# Altium project High Power Brushed DC MC.PrjPcb
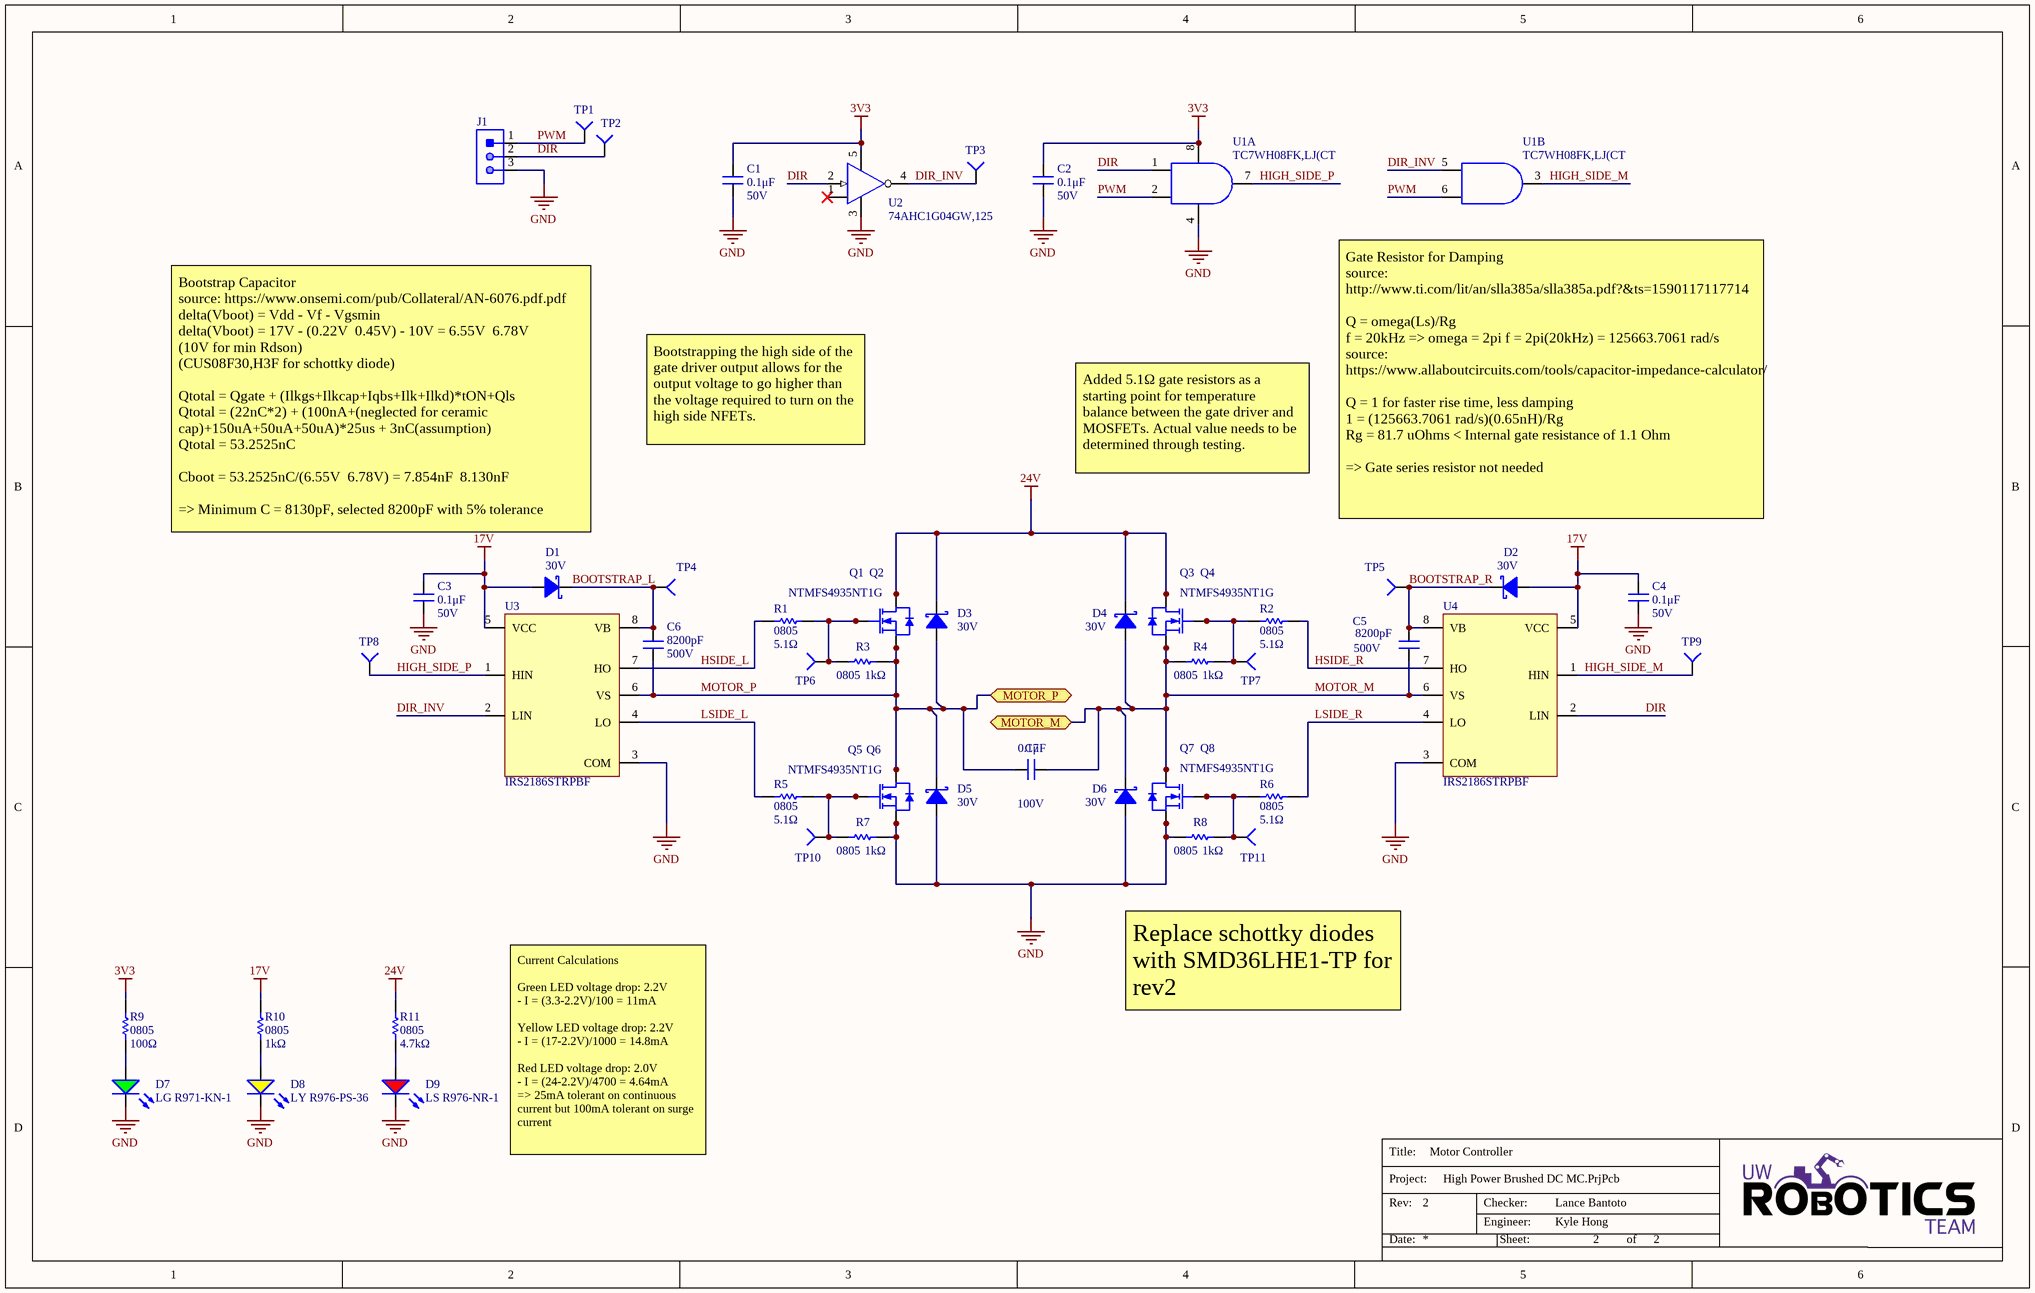
[diagram p0: SH2 - MOTOR CONTROLLER.SchDoc]
2 sheets, 83 parts. Net scope: flat (ports and power ports of the same name join across sheets).
Board file: High Power Brushed DC MC.PcbDoc
Sheets:
  SH2 - MOTOR CONTROLLER.SchDoc
  SH1 - CONNECTORS AND POWER.SchDoc

## Sheet SH2 - MOTOR CONTROLLER.SchDoc: Motor Controller
size B; CheckedBy: Lance Bantoto; DrawnBy: K Hong; Engineer: Kyle Hong; Revision: 2; SheetNumber: 2; SheetTotal: 2

### Parts
C1  Voltage Rating: 50V  [CAP2012]  (hidden comment: 0.1μF)
C2  Voltage Rating: 50V  [CAP2012]  (hidden comment: 0.1μF)
C3  Voltage Rating: 50V  [CAP2012]  (hidden comment: 0.1μF)
C4  Voltage Rating: 50V  [CAP2012]  (hidden comment: 0.1μF)
C5  value 8200pF  Voltage Rating (DC): 500V  [CAP1206]  (hidden comment: CAP_8200pF_500V_1206)
C6  value 8200pF  Voltage Rating (DC): 500V  [CAP1206]  (hidden comment: CAP_8200pF_500V_1206)
C7  value 0.1μF  Voltage(DC): 100V  [MKS2D031001A00MSSD]  (hidden comment: CAP_0.1uF_100V_FILM)
D1  Vr (Max): 30V  [SOD-323_UNIDIR]  (hidden comment: DIO_SCHOTTKY_30V_800mA)
D2  Vr (Max): 30V  [SOD-323_UNIDIR]  (hidden comment: DIO_SCHOTTKY_30V_800mA)
D3  Vr (Max): 30V  [SOD-323_UNIDIR]  (hidden comment: DIO_SCHOTTKY_30V_800mA)
D4  Vr (Max): 30V  [SOD-323_UNIDIR]  (hidden comment: DIO_SCHOTTKY_30V_800mA)
D5  Vr (Max): 30V  [SOD-323_UNIDIR]  (hidden comment: DIO_SCHOTTKY_30V_800mA)
D6  Vr (Max): 30V  [SOD-323_UNIDIR]  (hidden comment: DIO_SCHOTTKY_30V_800mA)
D7  LG R971-KN-1  [LED_0805_GREEN]
D8  LY R976-PS-36  [LED_0805_YELLOW]
D9  LS R976-NR-1  [LED_0805_RED]
J1  CON_3M_TERM  [1935174]  (value not drawn)
Q1  NTMFS4935NT1G  [SO8-FL]  (value not drawn)
Q2  NTMFS4935NT1G  [SO8-FL]
Q3  NTMFS4935NT1G  [SO8-FL]
Q4  NTMFS4935NT1G  [SO8-FL]  (value not drawn)
Q5  NTMFS4935NT1G  [SO8-FL]  (value not drawn)
Q6  NTMFS4935NT1G  [SO8-FL]
Q7  NTMFS4935NT1G  [SO8-FL]  (value not drawn)
Q8  NTMFS4935NT1G  [SO8-FL]
R1  value 5.1Ω  Case Code (Imperial): 0805  [RESC2012X60N]  (hidden comment: RES_5.1Ω_0805)
R2  value 5.1Ω  Case Code (Imperial): 0805  [RESC2012X60N]  (hidden comment: RES_5.1Ω_0805)
R3  Case Code (Imperial): 0805  [RESC2012X60N]  (hidden comment: 1kΩ)
R4  Case Code (Imperial): 0805  [RESC2012X60N]  (hidden comment: 1kΩ)
R5  value 5.1Ω  Case Code (Imperial): 0805  [RESC2012X60N]  (hidden comment: RES_5.1Ω_0805)
R6  value 5.1Ω  Case Code (Imperial): 0805  [RESC2012X60N]  (hidden comment: RES_5.1Ω_0805)
R7  Case Code (Imperial): 0805  [RESC2012X60N]  (hidden comment: 1kΩ)
R8  Case Code (Imperial): 0805  [RESC2012X60N]  (hidden comment: 1kΩ)
R9  value 100Ω  Case Code (Imperial): 0805  [RESC2012X60N]  (hidden comment: RES_100Ω_0805)
R10  Case Code (Imperial): 0805  [RESC2012X60N]  (hidden comment: 1kΩ)
R11  value 4.7kΩ  Case Code (Imperial): 0805  [RESC2012X60N]  (hidden comment: RES_4.7kΩ_0805)
TP1  TESTPOINT_1MM_CIRCLE  [TESTPOINT_CIRCLE_1MM]  (value not drawn)  (no BOM)
TP2  TESTPOINT_1MM_CIRCLE  [TESTPOINT_CIRCLE_1MM]  (value not drawn)  (no BOM)
TP3  TESTPOINT_1MM_CIRCLE  [TESTPOINT_CIRCLE_1MM]  (value not drawn)  (no BOM)
TP4  TESTPOINT_1MM_CIRCLE  [TESTPOINT_CIRCLE_1MM]  (value not drawn)  (no BOM)
TP5  TESTPOINT_1MM_CIRCLE  [TESTPOINT_CIRCLE_1MM]  (value not drawn)  (no BOM)
TP6  TESTPOINT_1MM_CIRCLE  [TESTPOINT_CIRCLE_1MM]  (value not drawn)  (no BOM)
TP7  TESTPOINT_1MM_CIRCLE  [TESTPOINT_CIRCLE_1MM]  (value not drawn)  (no BOM)
TP8  TESTPOINT_1MM_CIRCLE  [TESTPOINT_CIRCLE_1MM]  (value not drawn)  (no BOM)
TP9  TESTPOINT_1MM_CIRCLE  [TESTPOINT_CIRCLE_1MM]  (value not drawn)  (no BOM)
TP10  TESTPOINT_1MM_CIRCLE  [TESTPOINT_CIRCLE_1MM]  (value not drawn)  (no BOM)
TP11  TESTPOINT_1MM_CIRCLE  [TESTPOINT_CIRCLE_1MM]  (value not drawn)  (no BOM)
U1  TC7WH08FK,LJ(CT  [8-VFSOP]  (parts A,B of 2)
U2  74AHC1G04GW,125  [SOT353]
U3  IRS2186STRPBF  [8-SOIC_M]
U4  IRS2186STRPBF  [8-SOIC_M]

### Ports
MOTOR_M (bidir), MOTOR_P (bidir)

### Nets
3V3: C1.2 C2.2 R9.2 U1.8(Vcc) U2.5(Vcc)
17V: C3.2 C4.2 D1.1(Anode) D2.1(Anode) R10.2 U3.5(VCC) U4.5(VCC)
24V: D3.2(Cathode) D4.2(Cathode) Q1.3(Drain) Q2.3(Drain) Q3.3(Drain) Q4.3(Drain) R11.2
GND: C1.1 C2.1 C3.1 C4.1 D5.1(Anode) D6.1(Anode) D7.2(K) D8.2(K) D9.2(K) J1.3 Q5.1(Source) Q6.1(Source) Q7.1(Source) Q8.1(Source) R7.2 R8.1 U1.4(GND) U2.3(GND) U3.3(COM) U4.3(COM)
BOOTSTRAP_L: C6.2 D1.2(Cathode) TP4.1(=value) U3.8(VB)
BOOTSTRAP_R: C5.2 D2.2(Cathode) TP5.1(=value) U4.8(VB)
DIR: J1.2 TP2.1(=value) U1.1(A1) U2.2(A) U4.2(LIN)
DIR_INV: TP3.1(=value) U1.5(A2) U2.4(Y) U3.2(LIN)
HIGH_SIDE_M: TP9.1(=value) U1.3(Y2) U4.1(HIN)
HIGH_SIDE_P: TP8.1(=value) U1.7(Y1) U3.1(HIN)
HSIDE_L: R1.1 U3.7(HO)
HSIDE_R: R2.2 U4.7(HO)
LSIDE_L: R5.1 U3.4(LO)
LSIDE_R: R6.2 U4.4(LO)
MOTOR_M: C5.1 C7.2 D4.1(Anode) D6.2(Cathode) Q3.1(Source) Q4.1(Source) Q7.3(Drain) Q8.3(Drain) R4.1 U4.6(VS) ; port MOTOR_M
MOTOR_P: C6.1 C7.1 D3.1(Anode) D5.2(Cathode) Q1.1(Source) Q2.1(Source) Q5.3(Drain) Q6.3(Drain) R3.2 U3.6(VS) ; port MOTOR_P
PWM: J1.1 TP1.1(=value) U1.2(B1) U1.6(B2)
NetD7_1: D7.1(A) R9.1
NetD8_1: D8.1(A) R10.1
NetD9_1: D9.1(A) R11.1
NetQ1_2: Q1.2(Gate) Q2.2(Gate) R1.2 R3.1 TP6.1(=value)
NetQ3_2: Q3.2(Gate) Q4.2(Gate) R2.1 R4.2 TP7.1(=value)
NetQ5_2: Q5.2(Gate) Q6.2(Gate) R5.2 R7.1 TP10.1(=value)
NetQ7_2: Q7.2(Gate) Q8.2(Gate) R6.1 R8.2 TP11.1(=value)

Not connected (* = marked no-connect by the designer): U2 1(NC)*

### Notes on the sheet
- Bootstrapping the high side of the gate driver output allows for the output voltage to go higher than the voltage required to turn on the high side NFETs.
- Added 5.1Ω gate resistors as a starting point for temperature balance between the gate driver and MOSFETs. Actual value needs to be determined through testing.
- Bootstrap Capacitor
  source: https://www.onsemi.com/pub/Collateral/AN-6076.pdf.pdf
  delta(Vboot) = Vdd - Vf - Vgsmin
  delta(Vboot) = 17V - (0.22V  0.45V) - 10V = 6.55V  6.78V
  (10V for min Rdson)
  (CUS08F30,H3F for schottky diode)
  Qtotal = Qgate + (Ilkgs+Ilkcap+Iqbs+Ilk+Ilkd)*tON+Qls
  Qtotal = (22nC*2) + (100nA+(neglected for ceramic cap)+150uA+50uA+50uA)*25us + 3nC(assumption)
  Qtotal = 53.2525nC
  Cboot = 53.2525nC/(6.55V  6.78V) = 7.854nF  8.130nF
  => Minimum C = 8130pF, selected 8200pF with 5% tolerance
- Gate Resistor for Damping
  source: http://www.ti.com/lit/an/slla385a/slla385a.pdf?&ts=1590117117714
  Q = omega(Ls)/Rg
  f = 20kHz => omega = 2pi f = 2pi(20kHz) = 125663.7061 rad/s
  source: https://www.allaboutcircuits.com/tools/capacitor-impedance-calculator/
  Q = 1 for faster rise time, less damping
  1 = (125663.7061 rad/s)(0.65nH)/Rg
  Rg = 81.7 uOhms < Internal gate resistance of 1.1 Ohm
  => Gate series resistor not needed
- Replace schottky diodes with SMD36LHE1-TP for rev2
- Current Calculations
  Green LED voltage drop: 2.2V
  - I = (3.3-2.2V)/100 = 11mA
  Yellow LED voltage drop: 2.2V
  - I = (17-2.2V)/1000 = 14.8mA
  Red LED voltage drop: 2.0V
  - I = (24-2.2V)/4700 = 4.64mA
  => 25mA tolerant on continuous current but 100mA tolerant on surge current
- Title:
- Project:
- Date:
- Rev:
- Checker:
- Engineer:
- Sheet:
- of

### Library data of the parts
C1-C4 = CAP_0.1uF_50V_0805: CAP CER 0.1UF 50V X7R 0805; Manufacturer 1: Murata Electronics; Manufacturer Part Number 1: GCD21BR71H104KA01L; Tolerance: 10%; Mount: Surface Mount; Case Code (Metric): 2012; Case Code (Imperial): 0805; Min Operating Temperature: -55°C; Max Operating Temperature: 125°C; Dielectric: X7R; Termination: SMD/SMT; Length: 2mm; Height: 1.25mm; Width: 0.049inch; Thickness: 0.049inch; Depth: 1.25mm; Ratings: AEC-Q200; Supplier 1: Digi-Key; Supplier Part Number 1: 490-11955-1-ND; Value: 0.1μF; Package: 0805 (2012 Metric)
C5 C6 = CAP_8200pF_500V_1206: CAP CER 0.0082uF 500Vdc C0G 5% 1206; Manufacturer 1: KEMET; Manufacturer Part Number 1: C1206C822JCGACAUTO; Dielectric: C0G, NP0; Supplier 1: Digi-Key; Category: Ceramic Capacitors; Tolerance: 5%; Supplier Part Number 1: 399-14847-1-ND; Package: 1206 (3216 Metric); Case Code (Imperial): 1206; Case Code (Metric): 3216; Voltage Rating: 500V
C7 = CAP_0.1uF_100V_FILM: CAP FILM 0.1UF 100V RADIAL; Manufacturer 1: WIMA; Tolerance: 20%; Dielectric: PET; Lead Diameter: 0.5mm; Voltage(AC): 63V; Min Operating Temperature: -55°C; Max Operating Temperature: 100°C; Length: 7.2mm; Depth: 2.5mm; Supplier 1: Digi-Key; Supplier Part Number 1: 1928-1656-ND; Manufacturer Part Number 1: MKS2D031001A00MSSD; Category: Film Capacitors; Lead Pitch: 5mm; Voltage Rating: 100V
D1-D6 = DIO_SCHOTTKY_30V_800mA: DIODE SCHOTTKY 30V 800MA USC; Manufacturer 1: Toshiba Semiconductor and Storage; Manufacturer Part Number 1: CUS08F30,H3F; Vf (Max): 220mV; Supplier 1: Digi-Key; Supplier Part Number 1: CUS08F30H3FCT-ND; Mount: Surface Mount; Io: 800mA
D7 = DIO_LED_G: LED GREEN DIFFUSED 0805 SMD; Manufacturer 1: OSRAM; Forward Voltage Drop: 2.2V; Package: 0805 (2012 Metric); Manufacturer Part Number 1: LG R971-KN-1; Supplier Part Number 1: 475-1410-1-ND; Supplier 1: Digi-Key; Mount: Surface Mount
D8 = DIO_LED_Y: LED YELLOW DIFFUSED 0805 SMD; Manufacturer 1: OSRAM; Forward Voltage Drop: 2.2V; Package: 0805 (2012 Metric); Manufacturer Part Number 1: LY R976-PS-36; Supplier Part Number 1: 475-2560-1-ND; Supplier 1: Digi-Key; Mount: Surface Mount
D9 = DIO_LED_R: LED RED DIFFUSED 0805 SMD; Manufacturer 1: OSRAM; Forward Voltage Drop: 2V; Package: 0805 (2012 Metric); Manufacturer Part Number 1: LS R976-NR-1; Supplier Part Number 1: 475-1278-1-ND; Supplier 1: Digi-Key; Mount: Surface Mount
J1 = CON_3M_TERM: TERM BLK 3POS SIDE ENTRY 5MM; Manufacturer 1: Phoenix Contact; Number of Contacts: 3; Voltage Rating (DC): 320V; Number of Levels: 1; Current: 18A; Voltage: 300V; Max Current Rating: 16A; Voltage Rating: 250V; Current Rating: 17.5A; Wire Gauge (Max): 26AWG; Wire Gauge (Min): 12AWG; Approvals: UL,VDE,CB; Supplier 1: Digi-Key; Supplier Part Number 1: 277-1578-ND; Manufacturer Part Number 1: 1935174; Mount: Through Hole; Category: Terminal Blocks; Number of Pins: 3; Weight: 0.100531oz; Contact Material: Copper,Tin; Color: Green; Insulation Material: Nylon; Housing Material: Polyamide; Material: Nylon; Housing Color: Green; Termination: Solder; Orientation: Straight; Number of Positions Per Level: 3; Number of Positions: 3; Number of Circuits: 3; Number of Poles: 3; Number of Rows: 1; Max Supply Voltage: 250V; Length: 9mm; Height: 11.3mm; Pitch: 5mm; Depth: 9mm; Stripping Length: 5mm; Width: 15mm; Wire/Cable Gauge: 26AWG; REACH SVHC: Unknown; Flammability Rating: UL94 V-0
Q1-Q8 = NTMFS4935NT1G: MOSFET N-CH 30V 13A SO8FL; Manufacturer 1: ON Semiconductor; Continuous Drain Current (ID): 93A; Drain to Source Resistance: 3.2mR; Power Dissipation: 2.63W; Max Power Dissipation: 48W; Threshold Voltage: 1.63V; Turn-On Delay Time: 16.3ns; Turn-Off Delay Time: 27.5ns; Fall Time: 6.6ns; Number of Elements: 1; Input Capacitance: 4.85nF; Rise Time: 20ns; Element Configuration: Single; Gate to Source Voltage (Vgs): 20V; Supplier 1: Digi-Key; Category: MOSFETs; Case/Package: SO; Number of Pins: 5; Contact Plating: Tin,Matte; Min Operating Temperature: -55°C; Max Operating Temperature: 150°C; Drain to Source Breakdown Voltage: 30V; Drain to Source Voltage (Vdss): 30V; Nominal Vgs: 1.63V; Rds On Max: 3.2mR; Length: 5.1mm; Height: 1.1mm; Width: 6.1mm; REACH SVHC: No SVHC; Supplier Part Number 1: NTMFS4935NT1GOSCT-ND; Manufacturer Part Number 1: NTMFS4935NT1G
R1 R2 R5 R6 = RES_5.1Ω_0805_5%: RES 5.1 OHM 5% 1/8W 0805; Manufacturer 1: Panasonic; Manufacturer Part Number 1: ERJ-6GEYJ5R1V; Supplier 1: Digi-Key; Supplier Part Number 1: P5.1ACT-ND; Mount: Surface Mount; Case Code (Metric): 2012; Package: 0805 (2012 Metric)
R3 R4 R7 R8 R10 = RES_1kΩ_0805_1%: RES 1K OHM 1% 1/8W 0805; Manufacturer 1: Yageo; Manufacturer Part Number 1: RC0805FR-071KL; Power Rating: 125mW; Temperature Coefficient: 25ppm/°C; Voltage Rating: 150V; Supplier 1: Digi-Key; Case Code (Metric): 2012; Min Operating Temperature: -55°C; Max Operating Temperature: 155°C; Resistance: 1K; Tolerance: 1%; Termination: SMD/SMT; Supplier Part Number 1: 311-1.00KCRCT-ND; Value: 1kΩ; Package: 0805 (2012 Metric); Mount: Surface Mount; Case/Package: 0805; Number of Pins: 2; Weight: 0.000194oz; Contact Plating: Tin; Composition: Thin Film; Number of Terminations: 2; Voltage Rating (DC): 150V; Max Power Dissipation: 125mW; Features: Moisture Resistant,Automotive AEC-Q200,Anti-Sulfur; Military Standard: Not; Length: 2mm; Height: 0.022inch; Width: 0.049inch; Depth: 1.25mm; REACH SVHC: Unknown
R9 = RES_100Ω_0805_1%: RES 100 OHM 1% 1/8W 0805; Manufacturer 1: Yageo; Manufacturer Part Number 1: RC0805FR-07100RL; Power Rating: 125mW; Supplier 1: Digi-Key; Mount: Surface Mount; Case Code (Metric): 2012; Supplier Part Number 1: 311-100CRCT-ND; Package: 0805 (2012 Metric)
R11 = RES_4.7kΩ_0805_5%: RES 4.7K OHM 5% 1/8W 0805; Manufacturer 1: Yageo; Manufacturer Part Number 1: RC0805JR-074K7L; Resistance: 4.7kR; Power Rating: 125mW; Temperature Coefficient: 100ppm/°C; Voltage Rating: 150V; Supplier 1: Digi-Key; Case Code (Metric): 2012; Min Operating Temperature: -55°C; Max Operating Temperature: 155°C; Tolerance: 5%; Termination: SMD/SMT; Supplier Part Number 1: 311-4.7KARCT-ND; Contact Plating: Tin,Lead,Matte; Composition: Thick Film; Military Standard: Not; Length: 2mm; Depth: 1.25mm; REACH SVHC: Unknown; Mount: Surface Mount; Package: 0805 (2012 Metric)
TP1-TP11 = TESTPOINT_1MM_CIRCLE: TESTPOINT 1MM CIRCLE; Part Number (MPN): *
U1 = TC7WH08FK,LJ(CT: AND Gate 2-Element 2-IN CMOS Automotive 8-Pin SSOP T/R; Manufacturer 1: Toshiba; Number of Circuits: 2; Quiescent Current: 2uA; High Level Output Current: 8mA; Propagation Delay: 7.9ns; Supplier 1: Digi-Key; Category: Logic Gates; Mount: Surface Mount; Number of Pins: 8; Min Operating Temperature: -40°C; Max Operating Temperature: 85°C; Logic Function: AND; Number of Inputs: 2; Low Level Output Current: 8mA; Supplier Part Number 1: TC7WH08FKLJ(CTCT-ND; Manufacturer Part Number 1: TC7WH08FK,LJ(CT
U2 = 74AHC1G04GW,125: IC INVERTER 1CH 1-INP 5TSSOP; Manufacturer 1: Nexperia; Supplier 1: Digi-Key; Supplier Part Number 1: 1727-3147-1-ND; Manufacturer Part Number 1: 74AHC1G04GW,125
U3 U4 = IRS2186STRPBF: IC DRIVER HI/LO SIDE 600V 8-SOIC; Manufacturer 1: International Rectifier; Max Supply Current: 240uA; Number of Outputs: 2; Max Supply Voltage: 20V; Min Supply Voltage: 10V; Max Power Dissipation: 625mW; Fall Time: 30ns; Turn-Off Delay Time: 170ns; Rise Time: 38ns; Propagation Delay: 250ns; Max Output Current: 4A; Supplier 1: Digi-Key; Category: Gate Drivers; Mount: Surface Mount; Case/Package: SOIC; Number of Pins: 8; Min Operating Temperature: -40°C; Max Operating Temperature: 125°C; Number of Drivers: 2; Turn-On Delay Time: 170ns; Power Dissipation: 625mW; Output Current: 4A; Nominal Supply Current: 240uA; Supplier Part Number 1: IRS2186STRPBFCT-ND; Manufacturer Part Number 1: IRS2186STRPBF

## Sheet SH1 - CONNECTORS AND POWER.SchDoc: Connectors and Power
size B; CheckedBy: Lance Bantoto; Engineer: Kyle Hong; Revision: 2; SheetNumber: 1; SheetTotal: 2
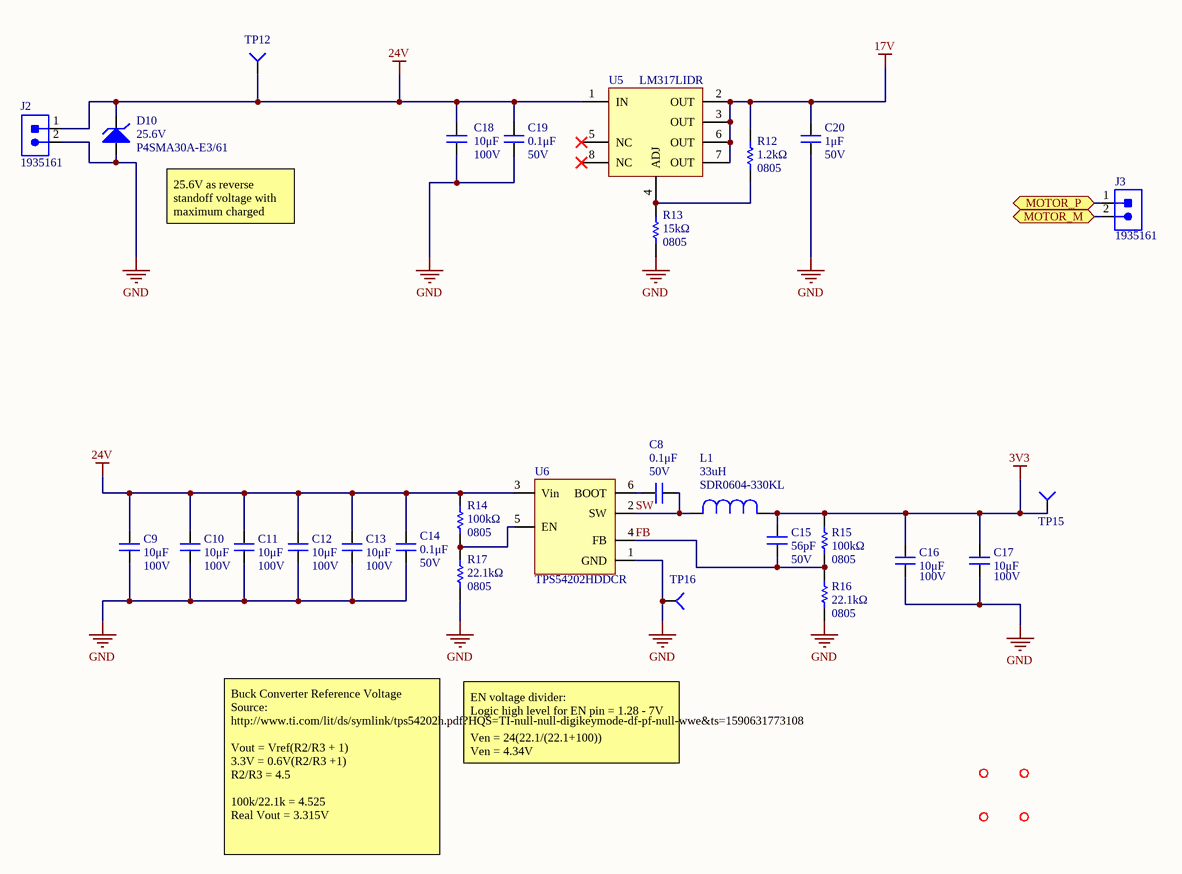
[diagram p1: SH1 - CONNECTORS AND POWER.SchDoc]

### Parts
C8  Voltage Rating: 50V  [CAP2012]  (hidden comment: 0.1μF)
C9  value 10μF  Voltage Rating: 100V  [CAP1210]  (hidden comment: CAP_10uF_100V_1210)
C10  value 10μF  Voltage Rating: 100V  [CAP1210]  (hidden comment: CAP_10uF_100V_1210)
C11  value 10μF  Voltage Rating: 100V  [CAP1210]  (hidden comment: CAP_10uF_100V_1210)
C12  value 10μF  Voltage Rating: 100V  [CAP1210]  (hidden comment: CAP_10uF_100V_1210)
C13  value 10μF  Voltage Rating: 100V  [CAP1210]  (hidden comment: CAP_10uF_100V_1210)
C14  Voltage Rating: 50V  [CAP2012]  (hidden comment: 0.1μF)
C15  value 56pF  Voltage Rating: 50V  [CAP2012]  (hidden comment: CAP_56pF_50V_0805)
C16  value 10μF  Voltage Rating: 100V  [CAP1210]  (hidden comment: CAP_10uF_100V_1210)
C17  value 10μF  Voltage Rating: 100V  [CAP1210]  (hidden comment: CAP_10uF_100V_1210)
C18  value 10μF  Voltage Rating: 100V  [CAP1210]  (hidden comment: CAP_10uF_100V_1210)
C19  Voltage Rating: 50V  [CAP2012]  (hidden comment: 0.1μF)
C20  value 1μF  Voltage Rating: 50V  [CAP2012]  (hidden comment: CAP_1uF_50V_0805)
D10  Reverse Standoff Voltage: 25.6V  [DO-214AC_UNI]  (hidden comment: P4SMA30A-E3/61)
J2  1935161  [1935161]
J3  1935161  [1935161]
L1  Manufacturer Part Number 1: SDR0604-330KL  Inductance: 33uH  [IND_BOURNS_SDR0604]  (hidden comment: IND_33uH_880mA)
MH1  MOUNTING_HOLES  [MOUNTING_HOLE]  (value not drawn)
MH2  MOUNTING_HOLES  [MOUNTING_HOLE]  (value not drawn)
MH3  MOUNTING_HOLES  [MOUNTING_HOLE]  (value not drawn)
MH4  MOUNTING_HOLES  [MOUNTING_HOLE]  (value not drawn)
R12  value 1.2kΩ  Case Code (Imperial): 0805  [RESC2012X60N]  (hidden comment: RES_1.2kΩ_0805)
R13  value 15kΩ  Case Code (Imperial): 0805  [RESC2012X60N]  (hidden comment: RES_15Ω_0805)
R14  Case Code (Imperial): 0805  Resistance: 100kΩ  [RESC2012X60N]  (hidden comment: RES_100kΩ_0805)
R15  Case Code (Imperial): 0805  Resistance: 100kΩ  [RESC2012X60N]  (hidden comment: RES_100kΩ_0805)
R16  Case Code (Imperial): 0805  Resistance: 22.1kΩ  [RESC2012X60N]  (hidden comment: RES_22.1kΩ_0805)
R17  Case Code (Imperial): 0805  Resistance: 22.1kΩ  [RESC2012X60N]  (hidden comment: RES_22.1kΩ_0805)
TP12  TESTPOINT_SMD_LOOP  [S1751-46R]  (value not drawn)
TP15  TESTPOINT_SMD_LOOP  [S1751-46R]  (value not drawn)
TP16  TESTPOINT_SMD_LOOP  [S1751-46R]  (value not drawn)
U5  LM317LIDR  [LM317LIDR]
U6  TPS54202HDDCR  [SOT23-6]

### Ports
MOTOR_M (bidir), MOTOR_P (bidir)

### Nets
3V3: C15.2 C16.2 C17.2 L1.1 R15.2 TP15.1(=value)
17V: C20.2 R12.2 U5.2(OUT) U5.3(OUT) U5.6(OUT) U5.7(OUT)
24V: C9.2 C10.2 C11.2 C12.2 C13.2 C14.2 C18.2 C19.2 D10.2 J2.1 R14.2 TP12.1(=value) U5.1(IN) U6.3(Vin)
GND: C9.1 C10.1 C11.1 C12.1 C13.1 C14.1 C16.1 C17.1 C18.1 C19.1 C20.1 D10.1 J2.2 R13.1 R16.1 R17.1 TP16.1(=value) U6.1(GND)
FB: C15.1 R15.1 R16.2 U6.4(FB)
MOTOR_M: J3.2 ; port MOTOR_M
MOTOR_P: J3.1 ; port MOTOR_P
SW: C8.2 L1.2 U6.2(SW)
NetC8_1: C8.1 U6.6(BOOT)
NetR12_1: R12.1 R13.2 U5.4(ADJ)
NetR14_1: R14.1 R17.2 U6.5(EN)

Not connected (* = marked no-connect by the designer): U5 5(NC)* 8(NC)*

### Notes on the sheet
- 25.6V as reverse standoff voltage with maximum charged condition in mind
- EN voltage divider:
  Logic high level for EN pin = 1.28 - 7V
  Ven = 24(22.1/(22.1+100))
  Ven = 4.34V
- Buck Converter Reference Voltage
  Source: http://www.ti.com/lit/ds/symlink/tps54202h.pdf?HQS=TI-null-null-digikeymode-df-pf-null-wwe&ts=1590631773108
  Vout = Vref(R2/R3 + 1)
  3.3V = 0.6V(R2/R3 +1)
  R2/R3 = 4.5
  100k/22.1k = 4.525
  Real Vout = 3.315V
- Title:
- Project:
- Date:
- Rev:
- Checker:
- Engineer:
- Sheet:
- of

### Library data of the parts
C8 C14 C19 = CAP_0.1uF_50V_0805: as C1 on sheet SH2 - MOTOR CONTROLLER; Mount: Surface Mount; Case Code (Metric): 2012; Case Code (Imperial): 0805; Min Operating Temperature: -55°C; Max Operating Temperature: 125°C; Dielectric: X7R; Termination: SMD/SMT; Length: 2mm; Height: 1.25mm; Width: 0.049inch; Thickness: 0.049inch; Depth: 1.25mm; Ratings: AEC-Q200; Supplier 1: Digi-Key; Supplier Part Number 1: 490-11955-1-ND; Value: 0.1μF; Package: 0805 (2012 Metric)
C9-C13 C16-C18 = CAP_10uF_100V_1210: CAP CER 10uF 100V X7S 10% 1210; Manufacturer 1: Murata; Manufacturer Part Number 1: GRM32EC72A106KE05L; Supplier 1: Digi-Key; Category: Ceramic Capacitors; Mount: Surface Mount; Case Code (Imperial): 1210; Case Code (Metric): 3225; Min Operating Temperature: -55°C; Max Operating Temperature: 125°C; Tolerance: 10%; Supplier Part Number 1: 490-16266-1-ND; Package: 1210 (3225 Metric); Dielectric: X7S
C15 = CAP_56pF_50V_0805: CAP CER 56PF 50V C0G/NP0; Manufacturer 1: Yageo; Manufacturer Part Number 1: CC0805FRNPO9BN560; Dielectric: C0G, NP0; Tolerance: 1%; Supplier 1: Digi-Key; Category: Ceramic Capacitors; Mount: Surface Mount; Weight: 0.000194oz; Case Code (Metric): 2012; Case Code (Imperial): 0805; Min Operating Temperature: -55°C; Max Operating Temperature: 125°C; Termination: SMD/SMT; Composition: Ceramic; Voltage Rating (DC): 50V; Length: 2mm; Height: 0.6mm; Depth: 1.25mm; Width: 0.049inch; Thickness: 0.028inch; Supplier Part Number 1: 311-4179-1-ND; Package: 0805 (2012 Metric)
C20 = CAP_1uF_50V_0805: CAP CER 1UF 50V X7R 0805; Manufacturer Part Number 1: CL21B105KBFNNNG; Manufacturer 1: Samsung Electro-Mechanics; Tolerane: ±10%; Package: 0805; Supplier Part Number 1: 1276-6470-1-ND; Supplier 1: Digi-Key; Mount: Surface Mount; Temperature Coefficient: X7R
D10 = P4SMA30A-E3/61: TVS DIODE, 400W, 25.6V, UNI, DO-214AC; Manufacturer 1: Vishay Semiconductors; Element Configuration: Single; Leakage Current: 1uA; Direction: Unidirectional; Reverse Breakdown Voltage: 28.5V; Max Surge Current: 40A; Number of Unidirectional Channels: 1; Clamping Voltage: 41.4V; Power Line Protection: No; Test Current: 1mA; Peak Pulse Current: 9.7A; Supplier 1: Digi-Key; Category: TVS Diodes; Mount: Surface Mount; Case/Package: SMA; Number of Pins: 2; Min Operating Temperature: -65°C; Max Operating Temperature: 150°C; Max Power Dissipation: 400W; Composition: Zener; Operating Supply Voltage: 25.6V; Polarity: Unidirectional; Min Breakdown Voltage: 28.5V; Peak Pulse Power: 400W; Breakdown Voltage: 28.5V; Number of Channels: 1; Max Reverse Leakage Current: 1uA; Number of Elements: 1; Supplier Part Number 1: P4SMA30A-E3/61GICT-ND; Manufacturer Part Number 1: P4SMA30A-E3/61
J2 J3 = CON_2M_TERM: TERM BLK 2POS SIDE ENTRY 5MM; Manufacturer 1: Phoenix Contact; Connector Type: Screw; Voltage Rating (DC): 320V; Max Current Rating: 16A; Max Supply Voltage: 250V; Current Rating: 17.5A; Number of Poles: 2; Number of Levels: 1; Current: 18A; Voltage: 300V; Wire Gauge (Max): 26AWG; Wire Gauge (Min): 12AWG; Approvals: UL; Supplier 1: Digi-Key; Mount: Through Hole; Number of Pins: 2; Weight: 0.067021oz; Contact Material: Copper,Tin; Insulation Material: Nylon; Housing Material: Polyamide; Housing Color: Green; Color: Green; Material: Nylon; Number of Rows: 1; Voltage Rating: 250V; Number of Positions: 2; Number of Positions Per Level: 2; Termination: Solder; Number of Contacts: 2; Number of Circuits: 2; Orientation: Straight; Length: 9mm; Height: 11.3mm; Width: 14.9mm; Pitch: 5mm; Depth: 9mm; Wire/Cable Gauge: 26AWG; Flammability Rating: UL94 V-0; REACH SVHC: Unknown; Supplier Part Number 1: 277-1667-ND; Manufacturer Part Number 1: 1935161
L1 = IND_33uH_880mA: IND, 33uH, 10%, 1 Element, Ferrite-Core, SMD; Manufacturer 1: Bourns; Max DC Current: 880mA; DC Resistance (DCR): 250mR; Test Frequency: 1kHz; Q Factor: 24; Self Resonant Frequency: 13MHz; Saturation Current: 1.1A; Shielding: Unshielded; Supplier 1: Digi-Key; Category: Fixed Inductors; Mount: Surface Mount; Case/Package: Nonstandard; Number of Pins: 2; Core Material: Ferrite; Min Operating Temperature: -40°C; Max Operating Temperature: 125°C; Tolerance: 10%; Termination: SMD/SMT; Composition: Wirewound; RMS Current (Irms): 880mA; DC Current: 880mA; Military Standard: Not; Resistance: 250MR; Inductance Tolerance: 10%; Current Rating: 880mA; Diameter: 5.8mm; Length: 0.228inch; Height: 4.8mm; Height - Seated (Max): 0.189inch; Width: 0.228inch; REACH SVHC: No SVHC; ComponentLink7URL: https://datasheet.ciiva.com/6689/sdr0604-6689450.pdf?src-supplier=Digi-Key; ComponentLink7Description: https://datasheet.ciiva.com/6689/sdr0604-6689450.pdf?src-supplier=Digi-Key; ComponentLink8URL: https://datasheet.ciiva.com/8515/sdr0604-8515983.pdf?src-supplier=Avnet; ComponentLink8Description: https://datasheet.ciiva.com/8515/sdr0604-8515983.pdf?src-supplier=Avnet; Supplier Part Number 1: SDR0604-330KLCT-ND
MH1-MH4 = MOUNTING_HOLES: 6cm x 6cm
R12 = RES_1.2kΩ_0805_1%: RES 1.2K OHM 1% 1/8W 0805 /; Manufacturer 1: Stackpole Electronics Inc; Manufacturer Part Number 1: RMCF0805FT1K20; Case Code (Metric): 0805; Tolerance: 1%; Mount: Surface Mount; Supplier Part Number 1: RMCF0805FT1K20CT-ND; Supplier 1: Digi-Key
R13 = RES_15kΩ_0805_1%: RES 15K OHM 1% 1/8W 0805 /; Manufacturer 1: Vishay Dale; Manufacturer Part Number 1: CRCW080515K0FKEA; Case Code (Metric): 0805; Tolerance: 1%; Mount: Surface Mount; Supplier Part Number 1: 541-15.0KCCT-ND; Supplier 1: Digi-Key
R14 R15 = RES_100kΩ_0805_0.5%: RES 100K OHM 0.5% 1/8W 0805; Manufacturer 1: Panasonic; Manufacturer Part Number 1: ERA-6AED104V; Power Rating: 125mW; Temperature Coefficient: 25ppm/°C; Voltage Rating: 200V; Supplier 1: Digi-Key; Category: Chip SMD Resistors; Mount: Surface Mount; Case Code (Metric): 2012; Contact Plating: Tin; Min Operating Temperature: -55°C; Max Operating Temperature: 155°C; Composition: Thin Film; Termination: SMD/SMT; Military Standard: Not; Length: 2mm; Height: 0.5mm; Depth: 1.25mm; Width: 1.25mm; Supplier Part Number 1: P123795CT-ND; Tolerance: 0.5%; Package: 0805 (2012 Metric)
R16 R17 = RES_22.1kΩ_0805_1%: RES 22.1K OHM 1% 1/8W 0805; Manufacturer 1: Vishay Dale; Manufacturer Part Number 1: CRCW080522K1FKEA; Power Rating: 125mW; Supplier 1: Digi-Key; Case Code (Metric): 2012; Min Operating Temperature: -55°C; Max Operating Temperature: 155°C; Tolerance: 1%; Termination: SMD/SMT; Supplier Part Number 1: 541-22.1KCCT-ND; Package: 0805 (2012 Metric)
TP12 TP15 TP16 = TESTPOINT_SMD_LOOP: PC TEST POINT SMD; Manufacturer 1: Harwin; Plating: Tin; Number of Ports: 1; Supplier 1: Digi-Key; Manufacturer Part Number 1: S1751-46R; RoHS: Yes; Category: Terminal Blocks; Stock 1: 159143; Pricing 1: 1=0.29000, 10=0.27700, 25=0.23760, 50=0.20200, 100=0.19400, 250=0.17424, 500=0.16632, 1000=0.13860 (USD); Mount: Surface Mount; Material: Brass,Copper Alloy; Contact Material: Copper,Copper Alloy; Contact Plating: Tin; Color: Natural; Termination: Solder; Orientation: Straight; Number of Contacts: 1; Package Quantity: 2500; Packaging: Tape and Reel; Length: 3.25mm; Height: 2mm; Depth: 2mm; Width: 1.65mm; Radiation Hardening: No; REACH SVHC: No SVHC; ComponentLink1URL: https://datasheet.ciiva.com:443/pdfs/VipMasterIC/IC/HRWN/HRWN-S-A0002541722/HRWN-S-A0004513972-1.pdf?src-supplier=IHS+Markit; ComponentLink1Description: https://datasheet.ciiva.com:443/pdfs/VipMasterIC/IC/HRWN/HRWN-S-A0002541722/HRWN-S-A0004513972-1.pdf?src-supplier=IHS+Markit; ComponentLink2URL: https://datasheet.ciiva.com/5224/2010page161-58228-5224784.pdf?src-supplier=Mouser; ComponentLink2Description: https://datasheet.ciiva.com/5224/2010page161-58228-5224784.pdf?src-supplier=Mouser; ComponentLink3URL: https://datasheet.ciiva.com/22631/1688119-22631153.pdf?src-supplier=Element14; ComponentLink3Description: https://datasheet.ciiva.com/22631/1688119-22631153.pdf?src-supplier=Element14; ComponentLink4URL: https://datasheet.ciiva.com/2917/s1751-2917604.pdf?src-supplier=Digi-Key; ComponentLink4Description: https://datasheet.ciiva.com/2917/s1751-2917604.pdf?src-supplier=Digi-Key; ComponentLink5URL: https://datasheet.ciiva.com/1462/1693781-1462652.pdf?src-supplier=Farnell; ComponentLink5Description: https://datasheet.ciiva.com/1462/1693781-1462652.pdf?src-supplier=Farnell; ComponentLink6URL: https://datasheet.ciiva.com/1454/1693781-1454941.pdf?src-supplier=Element14; ComponentLink6Description: https://datasheet.ciiva.com/1454/1693781-1454941.pdf?src-supplier=Element14; Supplier Part Number 1: 952-1478-1-ND
U5 = LDO_ADJ_100mA: IC REG LIN POS ADJ 100MA 8SOIC; Manufacturer 1: Texas Instruments; PSRR: 80dB ~ 65dB (120Hz); Voltage - Input (Max): 38V; Voltage - Output (Min/Fixed): 1.2V; Voltage - Output (Max): 32V; Current - Output: 100mA; Operating Temperature: -40C = 125C; Mounting Type: Surface Mount; Supplier 1: Digi-Key; Supplier Part Number 1: 296-20678-1-ND; Manufacturer Part Number 1: LM317LIDR
U6 = TPS54202HDDCR: IC REG BUCK ADJ 2A TSOT23-6; Manufacturer 1: Texas Instruments; Output Type: Adjustable; Output Configuration: Positive; Number of Outputs: 1; Min Input Voltage: 4.5V; Max Input Voltage: 28V; Min Output Voltage: 596mV; Switching Frequency: 500kHz; Synchronous Rectifier: Yes; Quiescent Current: 40uA; Supplier 1: Digi-Key; Category: Voltage Regulators - Switching; Mount: Surface Mount; Case/Package: SOT-23-6; Min Operating Temperature: -40°C; Max Operating Temperature: 125°C; Max Output Voltage: 28V; Output Current: 2A; Supplier Part Number 1: 296-44396-1-ND; Manufacturer Part Number 1: TPS54202HDDCR

## Nets that join several sheets
3V3: SH2 - MOTOR CONTROLLER (5 pins), SH1 - CONNECTORS AND POWER (6 pins)
17V: SH2 - MOTOR CONTROLLER (7 pins), SH1 - CONNECTORS AND POWER (6 pins)
24V: SH2 - MOTOR CONTROLLER (7 pins), SH1 - CONNECTORS AND POWER (14 pins)
GND: SH2 - MOTOR CONTROLLER (20 pins), SH1 - CONNECTORS AND POWER (18 pins)
MOTOR_M: SH2 - MOTOR CONTROLLER (10 pins), SH1 - CONNECTORS AND POWER (J3.2)
MOTOR_P: SH2 - MOTOR CONTROLLER (10 pins), SH1 - CONNECTORS AND POWER (J3.1)